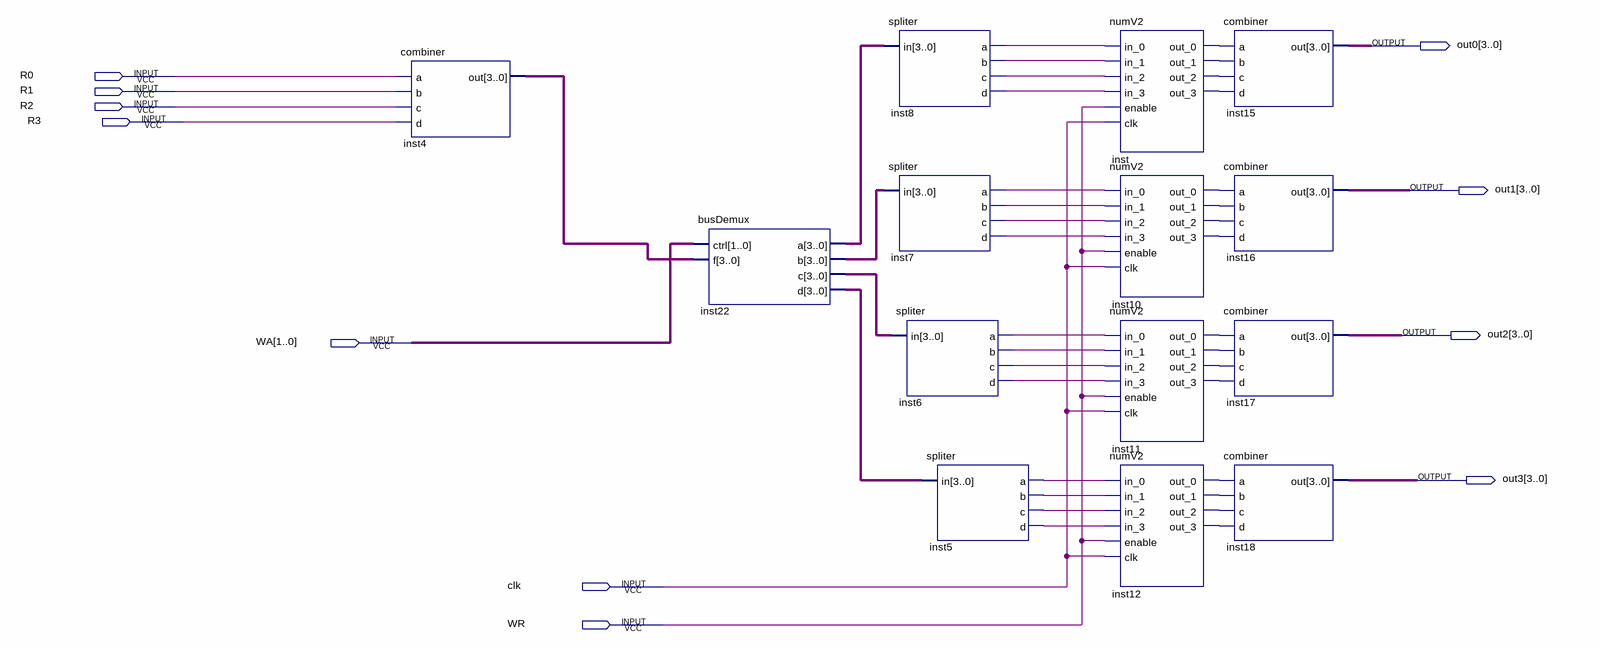
[diagram p0: schematic sheet]
// Quartus schematic regV2.bdf as structural Verilog: 14 symbols, 11 pins
module regV2 (
  input  R0,
  input  R1,
  input  R2,
  input  R3,
  input  [1:0] WA,
  input  clk,
  input  WR,
  output [3:0] out0,
  output [3:0] out1,
  output [3:0] out2,
  output [3:0] out3
);

  wire inst5_a, inst5_b, inst5_c, inst5_d, inst6_a, inst6_b, inst6_c, inst6_d, inst7_a, inst7_b, inst7_c,
       inst7_d, inst8_a, inst8_b, inst8_c, inst8_d, inst10_out_0, inst10_out_1, inst10_out_2, inst10_out_3,
       inst11_out_0, inst11_out_1, inst11_out_2, inst11_out_3, inst12_out_0, inst12_out_1, inst12_out_2,
       inst12_out_3, inst_out_0, inst_out_1, inst_out_2, inst_out_3;
  wire [3:0] inst4_out, inst22_a, inst22_b, inst22_c, inst22_d;

  combiner inst4 (.a(R0), .b(R1), .c(R2), .d(R3), .out(inst4_out));
  busDemux inst22 (.ctrl(WA), .f(inst4_out), .a(inst22_a), .b(inst22_b), .c(inst22_c), .d(inst22_d));
  spliter inst8 (.in(inst22_a), .a(inst8_a), .b(inst8_b), .c(inst8_c), .d(inst8_d));
  spliter inst7 (.in(inst22_b), .a(inst7_a), .b(inst7_b), .c(inst7_c), .d(inst7_d));
  spliter inst6 (.in(inst22_c), .a(inst6_a), .b(inst6_b), .c(inst6_c), .d(inst6_d));
  spliter inst5 (.in(inst22_d), .a(inst5_a), .b(inst5_b), .c(inst5_c), .d(inst5_d));
  numV2 inst (
    .in_0(inst8_a), .in_1(inst8_b), .in_2(inst8_c), .in_3(inst8_d), .enable(WR), .clk(clk),
    .out_0(inst_out_0), .out_1(inst_out_1), .out_2(inst_out_2), .out_3(inst_out_3));
  numV2 inst10 (
    .in_0(inst7_a), .in_1(inst7_b), .in_2(inst7_c), .in_3(inst7_d), .enable(WR), .clk(clk),
    .out_0(inst10_out_0), .out_1(inst10_out_1), .out_2(inst10_out_2), .out_3(inst10_out_3));
  numV2 inst11 (
    .in_0(inst6_a), .in_1(inst6_b), .in_2(inst6_c), .in_3(inst6_d), .enable(WR), .clk(clk),
    .out_0(inst11_out_0), .out_1(inst11_out_1), .out_2(inst11_out_2), .out_3(inst11_out_3));
  numV2 inst12 (
    .in_0(inst5_a), .in_1(inst5_b), .in_2(inst5_c), .in_3(inst5_d), .enable(WR), .clk(clk),
    .out_0(inst12_out_0), .out_1(inst12_out_1), .out_2(inst12_out_2), .out_3(inst12_out_3));
  combiner inst15 (.a(inst_out_0), .b(inst_out_1), .c(inst_out_2), .d(inst_out_3), .out(out0));
  combiner inst16 (.a(inst10_out_0), .b(inst10_out_1), .c(inst10_out_2), .d(inst10_out_3), .out(out1));
  combiner inst17 (.a(inst11_out_0), .b(inst11_out_1), .c(inst11_out_2), .d(inst11_out_3), .out(out2));
  combiner inst18 (.a(inst12_out_0), .b(inst12_out_1), .c(inst12_out_2), .d(inst12_out_3), .out(out3));
endmodule
